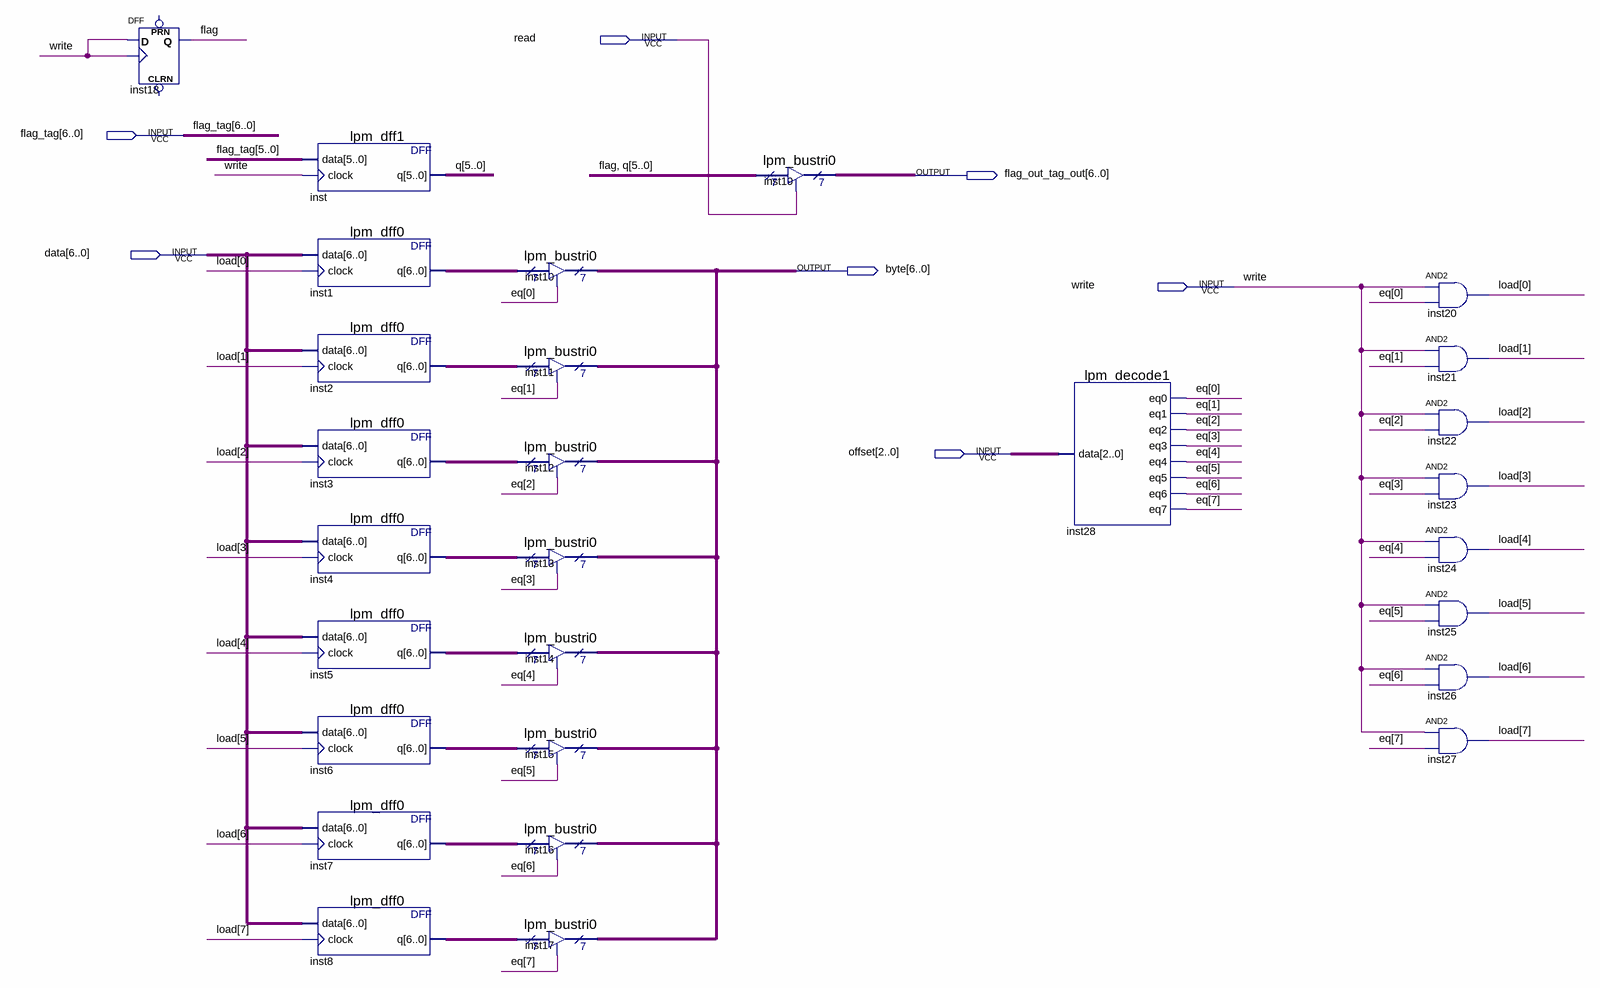
[diagram p0: schematic sheet]
// Quartus schematic raw.bdf as structural Verilog: 28 symbols, 7 pins
module raw (
  input  read,
  input  [6:0] flag_tag,
  input  [6:0] data,
  input  write,
  input  [2:0] offset,
  output [6:0] flag_out_tag_out,
  output [6:0] \byte 
);

  wire flag;
  wire [5:0] q;
  wire [6:0] inst1_q, inst2_q, inst3_q, inst4_q, inst5_q, inst6_q, inst7_q, inst8_q;
  wire [7:0] eq, load;

  DFF inst18 (.CLK(write), .D(write), .Q(flag));  // open: CLRN, PRN
  lpm_dff1 inst (.data(flag_tag[5:0]), .clock(write), .q(q));
  lpm_dff0 inst1 (.data(data), .clock(load[0]), .q(inst1_q));
  lpm_dff0 inst2 (.data(data), .clock(load[1]), .q(inst2_q));
  lpm_dff0 inst3 (.data(data), .clock(load[2]), .q(inst3_q));
  lpm_dff0 inst4 (.data(data), .clock(load[3]), .q(inst4_q));
  lpm_dff0 inst5 (.data(data), .clock(load[4]), .q(inst5_q));
  lpm_dff0 inst6 (.data(data), .clock(load[5]), .q(inst6_q));
  lpm_dff0 inst7 (.data(data), .clock(load[6]), .q(inst7_q));
  lpm_dff0 inst8 (.data(data), .clock(load[7]), .q(inst8_q));
  lpm_bustri0 inst10 (.enabledt(eq[0]), .data(inst1_q), .tridata(\byte ));
  lpm_bustri0 inst11 (.enabledt(eq[1]), .data(inst2_q), .tridata(\byte ));
  lpm_bustri0 inst12 (.enabledt(eq[2]), .data(inst3_q), .tridata(\byte ));
  lpm_bustri0 inst13 (.enabledt(eq[3]), .data(inst4_q), .tridata(\byte ));
  lpm_bustri0 inst14 (.enabledt(eq[4]), .data(inst5_q), .tridata(\byte ));
  lpm_bustri0 inst15 (.enabledt(eq[5]), .data(inst6_q), .tridata(\byte ));
  lpm_bustri0 inst16 (.enabledt(eq[6]), .data(inst7_q), .tridata(\byte ));
  lpm_bustri0 inst17 (.enabledt(eq[7]), .data(inst8_q), .tridata(\byte ));
  lpm_bustri0 inst19 (.enabledt(read), .data({flag, q}), .tridata(flag_out_tag_out));
  lpm_decode1 inst28 (
    .data(offset), .eq0(eq[0]), .eq1(eq[1]), .eq2(eq[2]), .eq3(eq[3]), .eq4(eq[4]), .eq5(eq[5]), .eq6(eq[6]),
    .eq7(eq[7]));
  and inst20 (load[0], write, eq[0]);
  and inst21 (load[1], write, eq[1]);
  and inst22 (load[2], write, eq[2]);
  and inst23 (load[3], write, eq[3]);
  and inst24 (load[4], write, eq[4]);
  and inst25 (load[5], write, eq[5]);
  and inst26 (load[6], write, eq[6]);
  and inst27 (load[7], write, eq[7]);
endmodule
